# Altium schematic sheet 发射端原理图.SchDoc
size A3; SheetNumber: 1; SheetTotal: 1
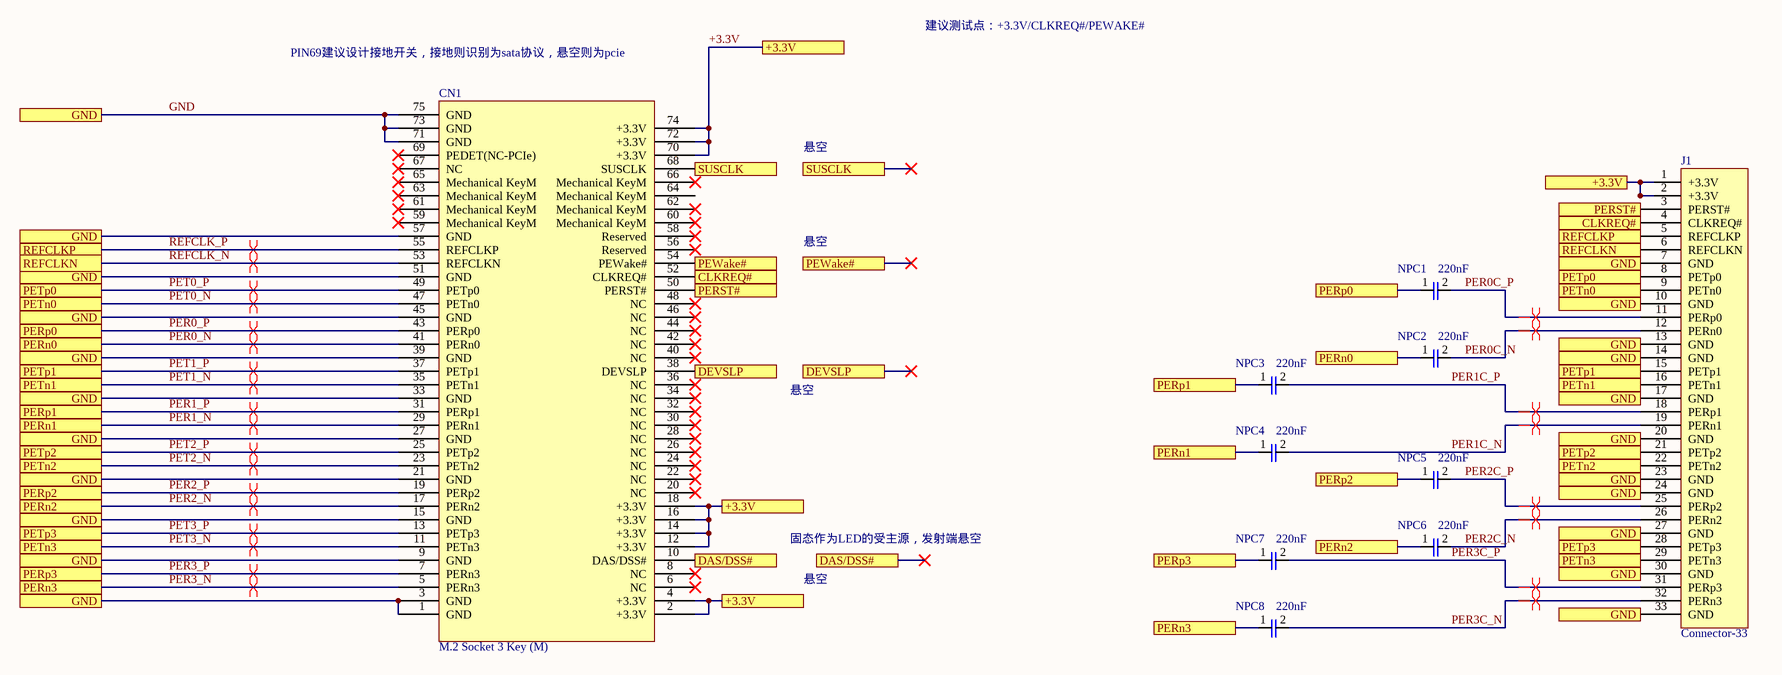
[diagram p0: 发射端原理图.SchDoc]

## Parts
CN1  M.2 Socket 3 Key (M)  [M.2 Insert]
J1  Connector-33  [b2b-hole]
NPC1  220nF  [0201C]
NPC2  220nF  [0201C]
NPC3  220nF  [0201C]
NPC4  220nF  [0201C]
NPC5  220nF  [0201C]
NPC6  220nF  [0201C]
NPC7  220nF  [0201C]
NPC8  220nF  [0201C]

## Ports
+3.3V, CLKREQ#, DAS/DSS#, DEVSLP, GND, PERn0, PERn1, PERn2, PERn3, PERp0, PERp1, PERp2, PERp3, PERST#, PETn0, PETn1, PETn2, PETn3, PETp0, PETp1, PETp2, PETp3, PEWake#, REFCLKN, REFCLKP, SUSCLK

## Nets
+3.3V: CN1.2(+3.3V) CN1.4(+3.3V) CN1.12(+3.3V) CN1.14(+3.3V) CN1.16(+3.3V) CN1.18(+3.3V) CN1.70(+3.3V) CN1.72(+3.3V) CN1.74(+3.3V) J1.1(+3.3V) J1.2(+3.3V) ; port +3.3V
CLKREQ#: CN1.52(CLKREQ#) J1.4(CLKREQ#) ; port CLKREQ#
DAS/DSS#: CN1.10(DAS/DSS#) ; port DAS/DSS#
DEVSLP: CN1.38(DEVSLP) ; port DEVSLP
GND: CN1.1(GND) CN1.3(GND) CN1.9(GND) CN1.15(GND) CN1.21(GND) CN1.27(GND) CN1.33(GND) CN1.39(GND) CN1.45(GND) CN1.51(GND) CN1.57(GND) CN1.71(GND) CN1.73(GND) CN1.75(GND) J1.7(GND) J1.10(GND) J1.13(GND) J1.14(GND) J1.17(GND) J1.20(GND) J1.23(GND) J1.24(GND) J1.27(GND) J1.30(GND) J1.33(GND) ; port GND
PER0_N: CN1.41(PERn0) NPC2.1 ; port PERn0
PER0_P: CN1.43(PERp0) NPC1.1 ; port PERp0
PER0C_N: J1.12(PERn0) NPC2.2
PER0C_P: J1.11(PERp0) NPC1.2
PER1_N: CN1.29(PERn1) NPC4.1 ; port PERn1
PER1_P: CN1.31(PERp1) NPC3.1 ; port PERp1
PER1C_N: J1.19(PERn1) NPC4.2
PER1C_P: J1.18(PERp1) NPC3.2
PER2_N: CN1.17(PERn2) NPC6.1 ; port PERn2
PER2_P: CN1.19(PERp2) NPC5.1 ; port PERp2
PER2C_N: J1.26(PERn2) NPC6.2
PER2C_P: J1.25(PERp2) NPC5.2
PER3_N: CN1.5(PERn3) NPC8.1 ; port PERn3
PER3_P: CN1.7(PERn3) NPC7.1 ; port PERp3
PER3C_N: J1.32(PERn3) NPC8.2
PER3C_P: J1.31(PERp3) NPC7.2
PERST#: CN1.50(PERST#) J1.3(PERST#) ; port PERST#
PET0_N: CN1.47(PETn0) J1.9(PETn0) ; port PETn0
PET0_P: CN1.49(PETp0) J1.8(PETp0) ; port PETp0
PET1_N: CN1.35(PETn1) J1.16(PETn1) ; port PETn1
PET1_P: CN1.37(PETp1) J1.15(PETp1) ; port PETp1
PET2_N: CN1.23(PETn2) J1.22(PETn2) ; port PETn2
PET2_P: CN1.25(PETp2) J1.21(PETp2) ; port PETp2
PET3_N: CN1.11(PETn3) J1.29(PETn3) ; port PETn3
PET3_P: CN1.13(PETp3) J1.28(PETp3) ; port PETp3
PEWake#: CN1.54(PEWake#) ; port PEWake#
REFCLK_N: CN1.53(REFCLKN) J1.6(REFCLKN) ; port REFCLKN
REFCLK_P: CN1.55(REFCLKP) J1.5(REFCLKP) ; port REFCLKP
SUSCLK: CN1.68(SUSCLK) ; port SUSCLK

Not connected (* = marked no-connect by the designer): CN1 6(NC)* 8(NC)* 20(NC)* 22(NC)* 24(NC)* 26(NC)* 28(NC)* 30(NC)* 32(NC)* 34(NC)* 36(NC)* 40(NC)* 42(NC)* 44(NC)* 46(NC)* 48(NC)* 56(Reserved)* 58(Reserved)* 59(Mechanical_KeyM)* 60(Mechanical_KeyM)* 61(Mechanical_KeyM)* 62(Mechanical_KeyM)* 63(Mechanical_KeyM)* 64(Mechanical_KeyM) 65(Mechanical_KeyM)* 66(Mechanical_KeyM)* 67(NC)* 69(PEDET(NC-PCIe))*

## Layout directives
differential pair: PER0_N, PER0_P, PER0C_N, PER0C_P, PER1_N, PER1_P, PER1C_N, PER1C_P, PER2_N, PER2_P, PER2C_N, PER2C_P, PER3_N, PER3_P, PER3C_N, PER3C_P, PET0_N, PET0_P, PET1_N, PET1_P, PET2_N, PET2_P, PET3_N, PET3_P, REFCLK_N, REFCLK_P

## Notes on the sheet
- 建议测试点：+3.3V/CLKREQ#/PEWAKE#
- PIN69建议设计接地开关，接地则识别为sata协议，悬空则为pcie
- 悬空
- 固态作为LED的受主源，发射端悬空

## Library data of the parts
NPC1-NPC8 = Nonp-Cap